# EasyEDA Pro project 【嘉立创】SguanFOC_MOTOR.epro, board PCB1
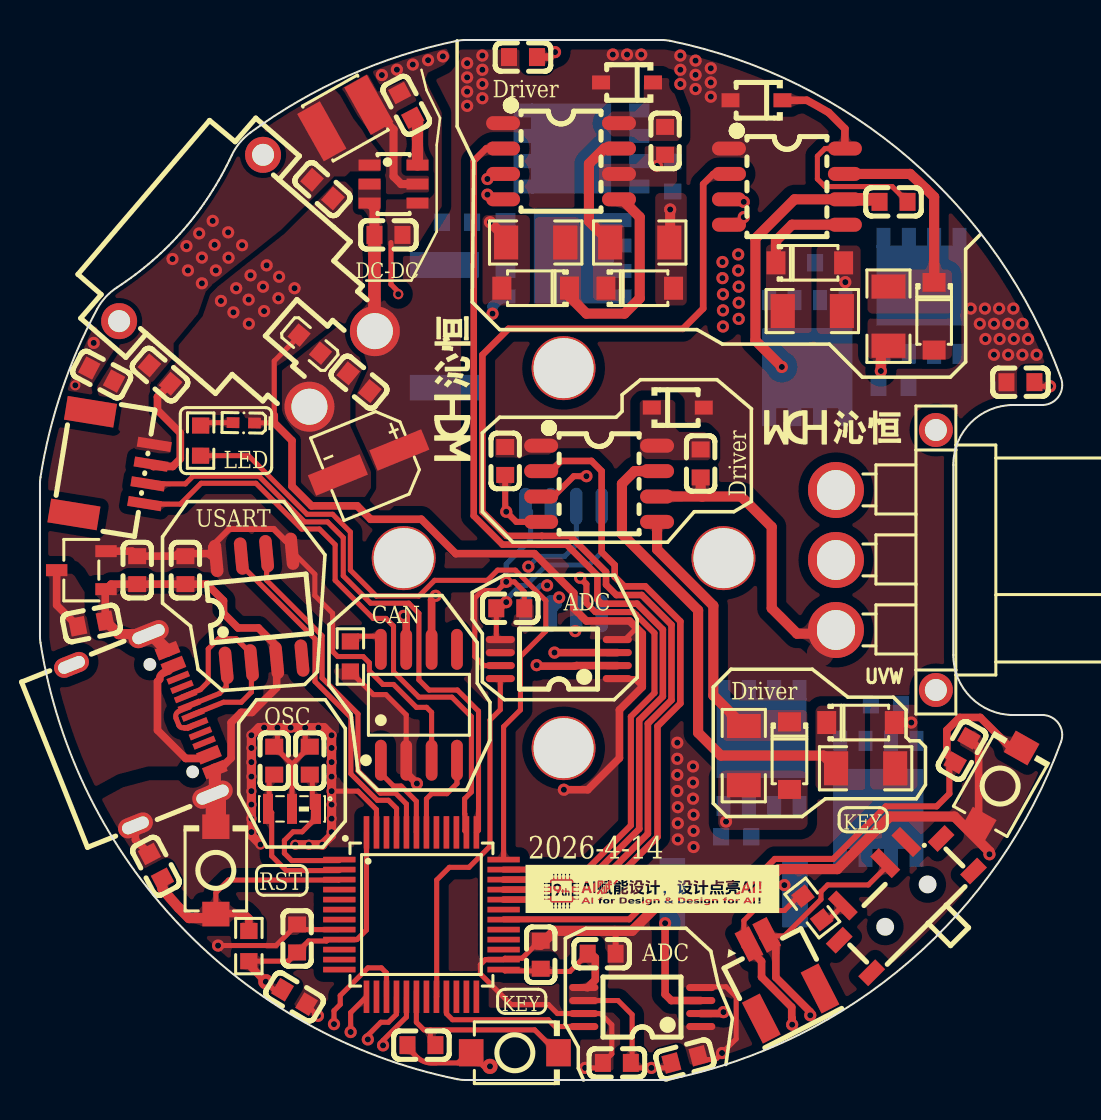
[diagram p1: board, top side]
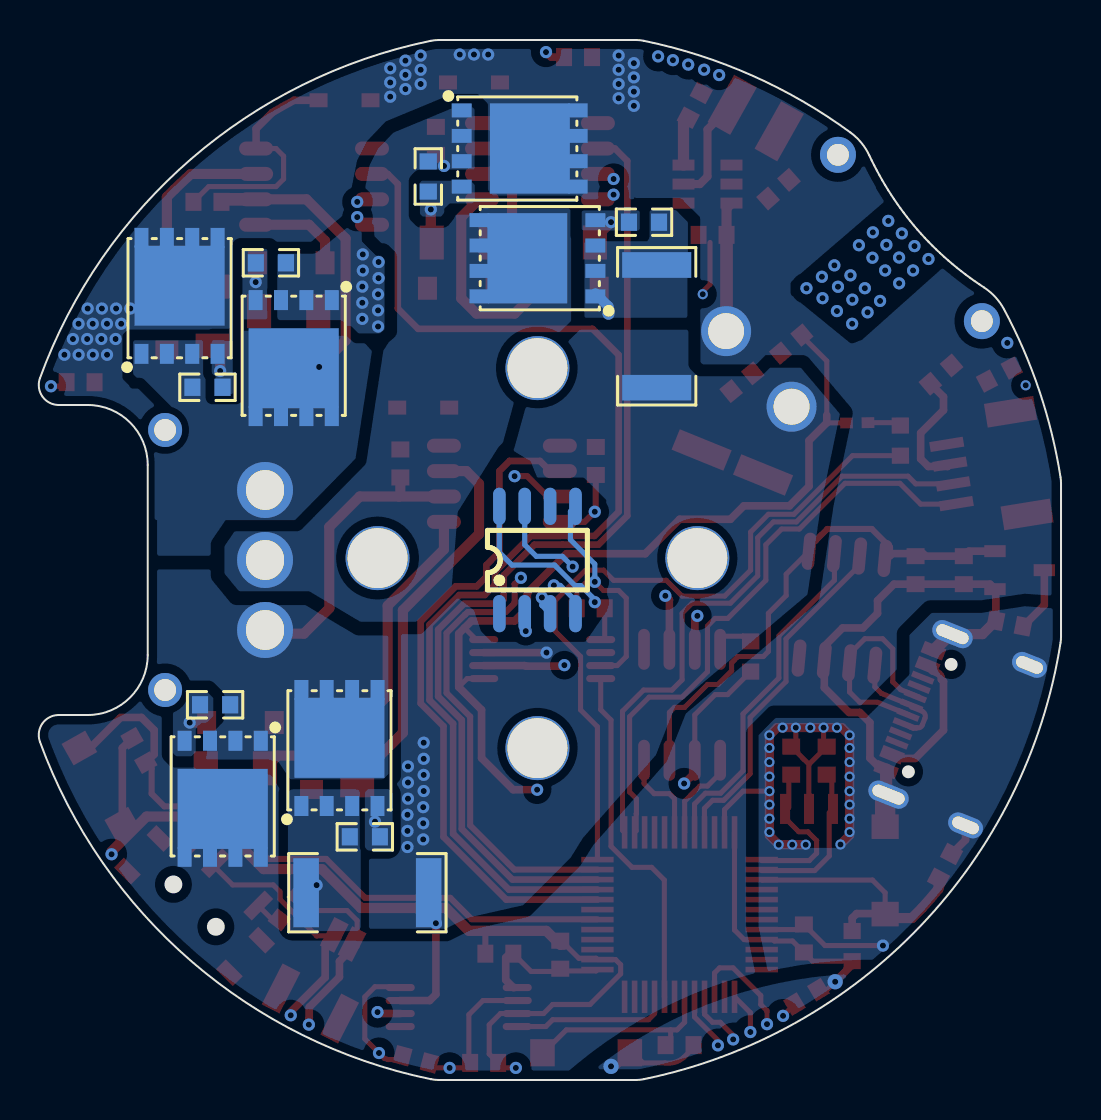
[diagram p2: board, bottom side, seen from below]

Outline 51.09 x 52 mm; copper layers: Top Layer, Inner1, Inner2, Bottom Layer. Coordinates in mm from the lower left corner of the outline.
Outline path: 0,29.82 0,22.18 arc(0.01,22.02) 0.02,21.87 arc(7.04,7.7) 20.87,0.04 arc(21.07,0.01) 21.28,0 31.12,0 arc(31.33,0.01) 31.53,0.04 arc(43.5,5.93) 51.09,16.91 arc(50.97,17.82) 50.15,18.25 48.7,18.25 arc(46.58,19.13) 45.7,21.25 45.7,30.75 arc(46.58,32.87) 48.7,33.75 50.15,33.75 arc(50.97,34.18) 51.09,35.09 arc(43.5,46.07) 31.53,51.96 arc(31.33,51.99) 31.12,52 21.28,52 arc(21.07,51.99) 20.87,51.96 arc(15.46,50.23) 10.54,47.38 arc(9.99,46.86) 9.6,46.23 9.47,45.98 9.35,45.72 9.22,45.48 9.08,45.23 8.94,44.99 8.8,44.75 8.66,44.51 8.51,44.28 8.36,44.05 8.2,43.82 8.04,43.59 7.88,43.37 7.71,43.16 7.54,42.94 7.37,42.73 7.19,42.52 7.01,42.32 6.83,42.12 6.64,41.92 6.44,41.72 6.25,41.53 6.05,41.34 5.85,41.16 5.64,40.97 5.43,40.79 5.21,40.62 5,40.44 4.78,40.28 4.55,40.11 4.32,39.95 4.09,39.78 3.85,39.63 arc(3.28,39.14) 2.85,38.54 arc(1.08,34.45) 0.02,30.13 arc(0.01,29.98) 0,29.82
Stack: Top Layer 0.035mm 外层铜厚1oz / Dielectric1 0.2104mm 7628 RC49% 8.6mil / Inner1 0.0152mm 内层铜厚 / Dielectric2 1.065mm 1.1mm H/HOZ Copper / Inner2 0.0152mm 内层铜厚 / Dielectric3 0.2104mm 7628 RC49% 8.6mil / Bottom Layer 0.035mm 外层铜厚1oz

## Design rules (mm)
net OSC-IN: DP1
net OSC-OUT: DP1
template: 自定义配置
spacing copperThickness1oz (default): track to track 0.102, other pairs 0.152 to 0.3
spacing copperThickness2oz: track to track 0.203, other pairs 0.152 to 0.3
track width copperThickness1oz (default): min 0.127, default 0.254, max 2.54
track width copperThickness2oz: min 0.203, default 0.254, max 2.54
differential pair differentialPair (default): width min 0.127, default 0.254, max 2.54; gap min 0.152, default 0.152
via viaSize (default): diameter min 0.5, default 0.61, max 10; hole min 0.3, default 0.305, max 6.3
net +3.3V uses sguan
net GND uses sguan
net +12V uses sguan
net A uses sguan
net B uses sguan
net AGND uses sguan
net +5V uses sguan
net C uses sguan
net $1N49078 uses sguan
net $1N49074 uses sguan
net MOS_AL uses sguan
net $1N49077 uses sguan
net MOS_AH uses sguan
net $1N49075 uses sguan
net MOS_BL uses sguan
net $1N49104 uses sguan
net MOS_BH uses sguan
net $1N49073 uses sguan
net MOS_CL uses sguan
net $1N49097 uses sguan
net MOS_CH uses sguan
net $1N49069 uses sguan
net I_A uses sguan
net $1N60408 uses sguan
net I_B uses sguan

## Placement (name value [footprint] x y rotation side)
C9  22uF  [C0603]  6.01 35.27 319.4 top
C10  22uF  [C0603]  14.14 44.54 318.4 top
C11  100nF  [C0603]  18.33 48.73 297.7 top
C12  10uF  [C0603]  17.44 42.26 0 top
C14  100nF  [C0603]  23.28 30.95 90 top
C15  100nF  [C0603]  32.27 1.03 194.9 top
C17  100nF  [C0603]  24.17 51.15 180 top
C19  100nF  [C0603]  49.06 34.89 180.2 top
C31  1uF  [C0603]  33.06 30.83 90 top
C32  1uF  [C0603]  31.28 46.95 90 top
C33  1uF  [C0603]  42.71 43.91 0 top
C37  10uF  [C0603]  4.86 25.49 90 top
C38  10uF  [C0603]  2.58 22.83 191.3 top
C57  100nF  [C0603]  5.8 10.68 297.8 top
C64  100nF  [C0603]  28.87 0.85 180 top
C65  100nF  [C0603]  23.53 23.59 0 top
C73  100nF  [C0603]  7.28 25.49 90 top
C74  100nF  [C0603]  12.86 7.08 270 top
C75  100nF  [C0603]  3.09 35.27 332.2 top
C76  22pF  [C0603]  13.5 15.97 90 top
C77  22pF  [C0603]  11.72 15.97 90 top
C78  10uF  [CAP-SMD_BD4.0-L4.3-W4.3-LS5.0-FD]  16.45 30.88 202.1 top
C79  22uF  [C0603]  15.96 34.89 140.7 top
C80  100nF  [C0603]  19.09 1.74 180 top
C81  100nF  [C0603]  12.74 4.16 149.1 top
C82  100nF  [C0603]  28.11 6.31 180 top
C85  100nF  [C0603]  25.06 6.26 270 top
C86  100nF  [C0603]  46.14 16.48 60.4 top
CAN  SN65HVD230DR  [SOIC-8_L4.9-W3.9-P1.27-LS6.0-BL]  18.96 18.76 0 top
CN  XT30PW-M  [CONN-TH_XT30PW-M]  11.34 38.83 229.1 top
D1  1N4148W-TP  [SOD-123_L2.8-W1.8-LS3.7-RD]  37.5 16.22 270 top
D2  1N4148W-TP  [SOD-123_L2.8-W1.8-LS3.7-RD]  41.06 17.87 0 top
D3  1N4148W-TP  [SOD-123_L2.8-W1.8-LS3.7-RD]  24.8 39.59 180 top
D4  1N4148W-TP  [SOD-123_L2.8-W1.8-LS3.7-RD]  30.01 39.59 0 top
D5  1N4148W-TP  [SOD-123_L2.8-W1.8-LS3.7-RD]  38.52 40.86 0 top
D6  1N4148W-TP  [SOD-123_L2.8-W1.8-LS3.7-RD]  44.74 38.19 270 top
DC-DC  AP63203WU-7  [TSOT-26_L2.9-W1.6-P0.95-LS2.8-BL]  17.69 44.8 270 top
L2  3.9uH  [IND-SMD_L3.0-W3.0_FNR30XXS]  15.28 48.1 29.4 top
MODE1  MSK12C02  [SW-TH_MSK12C02]  42.96 9.11 44.9 top
NOREF  -  [Pad_e203]  34.2 26.09 0 top
NOREF#2  -  [Pad_e201]  26.2 35.59 0 top
NOREF#3  -  [Pad_e204]  18.2 26.09 0 top
NOREF#4  -  [Pad_e202]  26.2 16.59 0 top
Q1  DON70N06  [DFN-8_L5.8-W4.9-P1.27-LS6.1-BL-2]  41.95 14.06 0 bottom
Q2  DON70N06  [DFN-8_L5.8-W4.9-P1.27-LS6.1-BL-2]  27.09 46.57 270 bottom
Q3  DON70N06  [DFN-8_L5.8-W4.9-P1.27-LS6.1-BL-2]  44.11 39.21 180 bottom
Q4  DON70N06  [DFN-8_L5.8-W4.9-P1.27-LS6.1-BL-2]  36.11 16.6 180 bottom
Q5  DON70N06  [DFN-8_L5.8-W4.9-P1.27-LS6.1-BL-2]  26.2 41.09 90 bottom
Q6  DON70N06  [DFN-8_L5.8-W4.9-P1.27-LS6.1-BL-2]  38.39 36.1 0 bottom
R3  100kΩ  [R0603]  42.33 18.76 0 bottom
R4  100kΩ  [R0603]  31.66 45.18 270 bottom
R5  100kΩ  [R0603]  42.71 34.64 180 bottom
R6  100kΩ  [R0603]  34.84 12.16 180 bottom
R7  100kΩ  [R0603]  20.87 42.89 0 bottom
R8  100kΩ  [R0603]  39.54 40.86 0 bottom
R11  2.2Ω  [R1206]  35.22 16.22 270 top
R12  2.2Ω  [R1206]  41.31 15.59 0 top
R13  2.2Ω  [R1206]  24.8 41.88 180 top
R14  2.2Ω  [R1206]  30.01 41.88 0 top
R15  2.2Ω  [R1206]  38.65 38.45 0 top
R16  2.2Ω  [R1206]  42.46 38.19 270 top
R34  5mΩ  [R2512]  20.23 37.68 90 bottom
R57  4.7kΩ  [R0603]  15.53 21.17 270 top
R58  120Ω  [R0603]  38.65 8.6 308 top
R59  CBM160808U000T  [L0603]  13.5 36.8 319.9 top
R60  10kΩ  [R0603]  10.45 6.7 90 top
R61  1kΩ  [R0603]  8.04 31.97 89.8 top
R63  5mΩ  [R2512]  34.71 9.36 0 bottom
SW1  TS-1088-AR02016  [SW-SMD_L3.9-W3.0-P4.45]  8.8 10.48 90 top
SW2  TS-1088-AR02016  [SW-SMD_L3.9-W3.0-P4.45]  23.76 1.36 0 top
SW3  TS-1088-AR02016  [SW-SMD_L3.9-W3.0-P4.45]  48.04 14.7 60.6 top
U6  EG2104  [SOP-8_L5.0-W4.0-P1.27-LS6.2-BL]  27.98 29.81 270 top
U8  XC6206P332MR-G  [SOT-23-3_L2.9-W1.6-P1.90-LS2.8-BR]  2.07 25.49 0 top
U9  KTH7823-X-N-SOP8  [SOP-8_L4.9-W3.9-P1.27-LS6.0-BL]  26.2 26 180 bottom
U10  FR107WS  [SOD-323_L1.6-W1.3-LS2.7-RD]  31.92 33.62 0 top
U11  EG2104  [SOP-8_L5.0-W4.0-P1.27-LS6.2-BL]  26.07 45.94 270 top
U12  FR107WS  [SOD-323_L1.6-W1.3-LS2.7-RD]  29.38 49.88 180 top
U13  EG2104  [SOP-8_L5.0-W4.0-P1.27-LS6.2-BL]  37.38 44.67 270 top
U14  FR107WS  [SOD-323_L1.6-W1.3-LS2.7-RD]  35.85 48.99 180 top
U28  XL-1005UOC  [LED0402-RD_ORANGE]  10.2 32.86 179 top
U34  INA240A2PWR  [TSSOP-8_L4.4-W3.0-P0.65-LS6.4-BL]  30.14 3.65 90 top
U35  INA240A2PWR  [TSSOP-8_L4.4-W3.0-P0.65-LS6.4-BL]  25.96 21.05 90 top
U38  ZX-SH1.0-2PWT  [CONN-SMD_2P-P1.00_HX-1.0-2P-WT]  36.74 5.43 27.1 top
U39  CH32V305CCT6  [LQFP-48_L7.0-W7.0-P0.50-LS9.0-BL_1]  19.09 8.27 270 top
UART  CH340N  [SOP-8_L4.9-W3.9-P1.27-LS6.0-BL]  10.96 23.59 5.4 top
USB  TYPE-C16PIN  [USB-C-SMD_TYPE-C16PIN]  5.37 17.62 291.7 top
UVW  MR30PW-F  [CONN-TH_MR30PW-F]  42.33 26 90 top
W-Link  SH1.0-4P  [CONN-SMD_4P-P1.00_SH1.0-4P]  3.8 30.57 260.8 top
X1  8MHz  [OSC-SMD_3P-L3.2-W1.3-P1.20]  12.61 13.55 180 top

## Footprints (pads in the part's own frame, mm; a bottom-side part is the same pattern mirrored in y, then rotated)
C0603
  rect 0.8x0.9 smd: 1(-0.7,0) 2(0.7,0)
CAP-SMD_BD4.0-L4.3-W4.3-LS5.0-FD
  rect 2.8x1.1 smd: 1(-1.661,0) 2(1.661,0)
CONN-SMD_2P-P1.00_HX-1.0-2P-WT
  rect 0.8x1.6 smd: 1(-0.5,1.8) 2(0.5,1.8)
  rect 1x2.3 smd: 3(1.65,-1.8) 4(-1.65,-1.8)
CONN-SMD_4P-P1.00_SH1.0-4P
  rect 0.5x1.7 smd: 1(-1.5,1.705) 2(-0.5,1.705) 3(0.5,1.705) 4(1.5,1.705)
  rect 1.2x2.5 smd: 5(-2.6,-1.705) 6(2.6,-1.705)
CONN-TH_MR30PW-F
  round 2.8 hole 1.995x1.9: 1(-3.5,2.5) 2(0,2.5) 3(3.5,2.5)
  round 1.7 hole 1.1: 4(6.5,-2.5) 5(-6.5,-2.5)
CONN-TH_XT30PW-M
  round 2.5 hole 1.8: 1(-2.5,5) 2(2.5,5)
  round 1.8 hole 1.1: 3(5.5,-5) 4(-5.5,-5)
DFN-8_L5.8-W4.9-P1.27-LS6.1-BL-2
  rect 0.7x1 smd: 1(-1.905,-2.9) 2(-0.635,-2.9) 3(0.635,-2.9) 4(1.905,-2.9) 5(1.905,2.9) 6(0.635,2.9) 7(-0.635,2.9) 8(-1.905,2.9)
  rect 4.51x4 smd: 8(0,0.508)
IND-SMD_L3.0-W3.0_FNR30XXS
  rect 1.3x2.72 smd: 1(1.35,0) 2(-1.35,0)
L0603
  rect 0.8x0.864 smd: 1(-0.7,0) 2(0.7,0)
LED0402-RD_ORANGE
  rect 0.636x0.54 smd: 1(-0.538,0) 2(0.538,0)
LQFP-48_L7.0-W7.0-P0.50-LS9.0-BL_1
  rect 0.28x1.62 smd: 1(-2.75,-4.11) 2(-2.25,-4.11) 3(-1.75,-4.11) 4(-1.25,-4.11) 5(-0.75,-4.11) 6(-0.25,-4.11) 7(0.25,-4.11) 8(0.75,-4.11) 9(1.25,-4.11) 10(1.75,-4.11) 11(2.25,-4.11) 12(2.75,-4.11) 25(2.75,4.11) 26(2.25,4.11) 27(1.75,4.11) 28(1.25,4.11) 29(0.75,4.11) 30(0.25,4.11) 31(-0.25,4.11) 32(-0.75,4.11) 33(-1.25,4.11) 34(-1.75,4.11) 35(-2.25,4.11) 36(-2.75,4.11)
  rect 1.62x0.28 smd: 13(4.11,-2.75) 14(4.11,-2.25) 15(4.11,-1.75) 16(4.11,-1.25) 17(4.11,-0.75) 18(4.11,-0.25) 19(4.11,0.25) 20(4.11,0.75) 21(4.11,1.25) 22(4.11,1.75) 23(4.11,2.25) 24(4.11,2.75) 37(-4.11,2.75) 38(-4.11,2.25) 39(-4.11,1.75) 40(-4.11,1.25) 41(-4.11,0.75) 42(-4.11,0.25) 43(-4.11,-0.25) 44(-4.11,-0.75) 45(-4.11,-1.25) 46(-4.11,-1.75) 47(-4.11,-2.25) 48(-4.11,-2.75)
OSC-SMD_3P-L3.2-W1.3-P1.20
  rect 0.5x1.5 smd: 1(-1.2,0) 2(0,0) 3(1.2,0)
Pad_e201
  round 3.2 hole 3: 1(0,0)
Pad_e202
  round 3.2 hole 3: 2(0,0)
Pad_e203
  round 3.2 hole 3: 3(0,0)
Pad_e204
  round 3.2 hole 3: 4(0,0)
R0603
  rect 0.806x0.864 smd: 1(-0.753,0) 2(0.753,0)
R1206
  rect 1.208x1.701 smd: 1(-1.479,0) 2(1.479,0)
R2512
  rect 1.282x3.456 smd: 1(-3.067,0) 2(3.067,0)
SOD-123_L2.8-W1.8-LS3.7-RD
  rect 0.95x1.15 smd: 1(-1.692,0) 2(1.692,0)
SOD-323_L1.6-W1.3-LS2.7-RD
  rect 0.9x0.7 smd: 1(-1.3,0) 2(1.3,0)
SOIC-8_L4.9-W3.9-P1.27-LS6.0-BL
  oval 0.588x2.045 smd: 1(-1.905,-2.772) 2(-0.635,-2.772) 3(0.635,-2.772) 4(1.905,-2.772) 5(1.905,2.772) 6(0.635,2.772) 7(-0.635,2.772) 8(-1.905,2.772)
SOP-8_L4.9-W3.9-P1.27-LS6.0-BL
  oval 0.63x1.865 smd: 1(-1.905,-2.683) 2(-0.635,-2.683) 3(0.635,-2.683) 4(1.905,-2.683) 5(1.905,2.683) 6(0.635,2.683) 7(-0.635,2.683) 8(-1.905,2.683)
SOP-8_L5.0-W4.0-P1.27-LS6.2-BL
  oval 0.7x1.7 smd: 1(-1.905,-2.9) 2(-0.635,-2.9) 3(0.635,-2.9) 4(1.905,-2.9) 5(1.905,2.9) 6(0.635,2.9) 7(-0.635,2.9) 8(-1.905,2.9)
SOT-23-3_L2.9-W1.6-P1.90-LS2.8-BR
  rect 1.07x0.6 smd: 1(1.235,-0.95) 2(1.235,0.95) 3(-1.235,0)
SW-SMD_L3.9-W3.0-P4.45
  rect 1.23x1.36 smd: 1(-2.185,0) 2(2.185,0)
SW-TH_MSK12C02
  rect 0.6x1.524 smd: 1(-2.25,1.7) 2(0.75,1.7) 3(2.25,1.7)
  rect 1.2x0.7 smd: 4(-3.6,0.6) 4(-3.6,-1.7) 4(3.6,0.6) 4(3.6,-1.7)
TSOT-26_L2.9-W1.6-P0.95-LS2.8-BL
  rect 0.55x1.1 smd: 1(-0.95,-1.2) 2(0,-1.2) 3(0.95,-1.2) 4(0.95,1.2) 5(0,1.2) 6(-0.95,1.2)
TSSOP-8_L4.4-W3.0-P0.65-LS6.4-BL
  oval 0.353x1.454 smd: 1(-0.975,-2.927) 2(-0.325,-2.927) 3(0.325,-2.927) 4(0.975,-2.927) 5(0.975,2.927) 6(0.325,2.927) 7(-0.325,2.927) 8(-0.975,2.927)
USB-C-SMD_TYPE-C16PIN
  oval 1x2.1 hole 0.6x1.7: 1(-4.32,1.788) 2(4.32,1.788)
  oval 1x1.8 hole 0.6x1.4: 3(-4.32,-2.362) 4(4.32,-2.362)
  rect 0.6x1.15 smd: A1B12(-3.2,2.363) A4B9(-2.4,2.362) B1A12(3.2,2.362) B4A9(2.4,2.362)
  rect 0.3x1.15 smd: A5(-1.25,2.362) A6(-0.25,2.362) A7(0.25,2.362) A8(1.25,2.362) B5(1.75,2.362) B6(0.75,2.362) B7(-0.75,2.362) B8(-1.75,2.362)

## Nets
As in the schematic.

Pads without a net: CAN 5; CN 3 4; MODE1 3 4; NOREF 3; NOREF#2 1; NOREF#3 4; NOREF#4 2; U9 1 6; U38 3 4; U39 4 5 6 7 10 11 12 14 19 22 23 24 27 28 29 31 39 40 41 46; UART 4; USB A5 A8 B5 B8; UVW 4 5; W-Link 5 6

## Via types
v1: diameter 0.61, hole 0.305, Top Layer to Bottom Layer, 134 vias
v2: diameter 0.762, hole 0.305, Top Layer to Bottom Layer, 2 vias
v3: diameter 0.508, hole 0.305, Top Layer to Bottom Layer, 27 vias

## Routing (per net, layer and track width the routed paths; a pad name or vN(x,y) marks a point on that pad's centre or on a via; arc(x,y) is an arc through that point)
+3.3V: length 68.1
  Top Layer w0.254: 27.21,3.97 28.92,3.97 29.63,3.27 29.63,0.92 C64.1 ; U35.5 22.83,22.02 C65.1 ; 12.6,26.44 13.75,25.29 13.75,24.22 14.64,23.33 14.64,21.43 14.9,21.17 16.17,21.17 16.48,20.86 16.48,20.45 17.16,19.78 17.69,19.78 18.83,18.63 19.34,18.63 19.6,18.38 19.6,15.99 ; v2(11.3,4.91) 11.7,4.52 C81.2 ; R60.1 12.43,5.94 C74.2 13.44,6.95 14.34,6.95 14.41,7.02 U39.9 15.86,7.02 16.34,7.5 U39.48 ; v2(22.52,0.68) 22.21,0.68 21.48,1.41 20.92,0.85 19.82,0.85 arc(19.31,0.89) 18.87,1.13 18.39,1.62 C80.2 ; 23.2,5.52 23.27,5.45 24.84,5.45 24.86,5.43 26.52,5.43 27.15,6.06 ; C15.2 31.35,0.6 v1(30.59,0.6) 29.56,0.6 29.31,0.85 ; 23.09,23.59 23.33,23.83 v1(23.33,23.89)
  Top Layer w0.305: 12.35,27.02 12.29,26.96 11.69,27.55 9.47,27.55 8.56,26.64 8.56,26.21
  Top Layer w0.381: 7.15,26.32 8.44,26.32 8.56,26.21 ; U8.2 4.61,26.44 4.86,26.19 6.77,26.19 6.9,26.32 ; v2(11.3,4.91) 10.45,5.76 R60.1 ; C82.2 27.59,6.31 27.79,6.12 27.79,5 27.41,4.62 27.34,4.62
  Bottom Layer w0.254: U9.8 28.11,26.38 27.47,25.75 25.34,25.75 24.32,24.72 24.03,24.72 23.33,24.02 v1(23.33,23.89)
  vias: v1(6.63,41.05) v1(7.33,41.7) v1(7.4,40.48) v1(7.97,42.33) v1(8.1,39.83) v1(8.1,41.12) v1(8.64,42.96) v1(8.74,41.76) v1(8.8,40.48) v1(9.42,42.38) v1(9.44,41.11) v1(10.11,41.74)
+5V: length 9.8
  Top Layer w0.381: C38.2 0.84,23.74 U8.3 ; 8.21,16.17 8.11,16.08 7.29,16.08 5.88,17.49 5.88,19.92 5.99,20.03 arc(6.04,20.23) 6.2,20.36 6.43,20.45 6.68,20.7 USB.A4B9
+12V: length 6.5
  Top Layer w0.508: C12.1 16.74,43.6 DC-DC.3
  Top Layer w0.635: CN.1 16.74,37.46 C12.1
  vias: v1(21.37,50.84) v1(21.37,50.13) v1(21.37,49.42) v1(21.37,48.71) v1(22.14,51.22) v1(22.14,50.51) v1(22.14,49.8) v1(22.14,49.09) v1(28.66,51.27) v1(29.38,51.27) v1(30.09,51.27) v1(32.04,51.22) v1(32.04,50.51) v1(32.04,49.8) v1(32.8,50.97) v1(32.8,50.26) v1(32.8,49.55) v1(33.57,50.59) v1(33.57,49.88) v1(33.57,49.17) v1(46.57,38.57) v1(47.03,37.81) v1(47.28,38.57) v1(47.31,37.05) v1(47.74,37.81) v1(47.73,36.26) v1(47.99,38.57) v1(48.02,37.05) v1(48.45,37.81) v1(48.45,36.26) v1(48.7,38.57) v1(48.73,37.05) v1(49.16,37.81) v1(49.16,36.26) v1(49.44,37.05) v1(49.87,36.26)
AGND: length 8.6
  Top Layer w0.381: U34.3 31.59,3.97 31.28,4.28 v1(31.28,7.84) ; v1(25.74,21.37) 28.89,21.37
  vias: v1(31.89,16.87) v1(31.89,16.06) v1(31.89,15.25) v1(31.89,14.45) v1(31.92,13.64) v1(31.92,12.84) v1(31.92,12.03) v1(32.68,15.68) v1(32.68,14.87) v1(32.68,14.07) v1(32.7,13.26) v1(32.7,12.45) v1(32.7,11.65) v1(34.15,40.9) v1(34.15,40.09) v1(34.17,39.29) v1(34.17,38.48) v1(34.17,37.67) v1(34.94,41.28) v1(34.94,40.47) v1(34.96,39.67) v1(34.96,38.86) v1(34.96,38.06)
GND: length 194.8
  Top Layer w0.254: v3(13.27,17.62) 13.27,16.9 C76.2 12.61,15.78 ; CAN.2 18.33,18.25 17.31,19.27 16.68,19.27 R57.2 ; 28.89,22.02 29.27,22.02 29.85,22.6 ; 11.72,32.86 10.75,32.86 10.74,32.85 ; C81.1 13.34,3.78 v1(13.91,3.21) ; v3(17.93,39.29) 17.93,39.42 17.56,39.78 17.56,41.88 ; v1(50.54,34.69) 49.97,34.69 49.76,34.89 ; C15.1 33.14,1.02 33.68,1.02 arc(33.77,1.05) 33.85,1.08 33.85,1.08 v1(34.13,1.35) 34.84,2.06 34.84,4.16 34.33,4.66 33.11,4.66 U34.4 ; 11.72,33.24 11.72,35.95 13.05,37.28 ; v1(8.91,6.72) 11.81,6.72 C74.1 13.12,7.52 U39.8 ; v3(14.59,14.44) 15.91,14.44 16.84,13.52 U39.47 ; 28.89,20.07 29.72,20.07 30.14,19.65 ; 12.61,15.78 C77.2 11.88,16.83 v3(11.88,17.62) ; 12.61,15.78 X1.2 ; C85.1 25.01,6.96 24.13,6.09 23.27,6.09 23.2,6.02 22.29,6.02 22.04,5.77 22.04,5.31 23.57,3.78 25.44,3.78 25.89,3.32 28.05,3.32 28.61,2.76 28.61,1.3 27.92,0.6 v1(27.28,0.6) ; U35.7 22.21,20.72 21.76,21.17 21.76,24.09 22.14,24.48 22.9,24.48 v1(23.33,24.91) 23.74,24.91 24.23,24.41 C65.2
  Top Layer w0.305: U6.4 23.84,27.91 v1(23.33,28.41) 23.28,28.46 C14.1 ; v1(35.22,43.14) 34.84,42.76 U13.4 ; 28.75,7.46 28.8,7.41 C82.1
  Top Layer w0.381: 5.56,30.79 5.68,30.68 6.64,30.68 7.02,31.06 7.02,32.35 5.88,33.49 5.88,34.16 6.54,34.82 ; v1(25.77,51.39) 25.52,51.15 24.87,51.15 ; C86.2 46.97,16.6 46.97,12.79 ; 11.72,33.24 11.72,32.86 12.61,31.97 12.61,29.68 13.59,28.71 15.87,28.71 16.54,28.04 19.08,28.04 20.8,26.31 24.74,26.31 26.71,24.35 26.71,23.59 27.34,22.95 29.5,22.95 30.14,22.32 30.14,19.65 28.99,18.51 28.99,16.09 27.41,14.51 v1(26.21,14.51) ; C38.1 3.26,24.5 U8.1 3.56,24.79 C37.1 C73.1 8.36,24.79 9.18,23.97 9.18,23.33 9.91,22.6 10.93,22.6 11.85,21.69 UART.3 11.85,19.62 10.61,18.38 10.07,18.38 9.56,17.87 9.56,16.09 8.99,15.52 USB.B1A12 ; v1(18.86,14.82) 18.33,15.36 CAN.2 ; C57.1 4.78,12 USB.4
  Top Layer w0.457: v3(11.04,11.78) 10.58,12.23 v3(10.58,12.4) v3(10.58,13.07) v3(10.58,13.77) v3(10.58,14.44) v3(10.58,15.17) v3(10.58,15.89) v3(10.58,16.6) v3(10.58,17.24) 10.96,17.62 v3(11.21,17.62) v3(11.88,17.62) v3(12.55,17.62) v3(13.27,17.62) v3(13.93,17.62) 14.21,17.62 v3(14.59,17.24) v3(14.59,16.6) v3(14.59,15.89) v3(14.59,15.17) v3(14.59,14.44) v3(14.59,13.77) v3(14.59,13.07) v3(14.59,12.4) 14.59,12.23 v3(14.13,11.76) v3(13.45,11.76) v3(12.78,11.76)
  Top Layer w0.508: C38.1 3.93,22.29 USB.1 ; 24.87,6.76 25.06,6.76 25.75,7.46 29.63,7.46 30.77,8.6 35.04,8.6 36.98,10.54 39.9,10.54 42.53,13.17 45.76,13.17 47.51,11.42 v1(47.51,11.29)
  Top Layer w0.61: USB.A1B12 5.55,22.29 USB.1 ; USB.B1A12 8.75,14.39
  Top Layer w1.016: 8.8,12.69 8.8,14.1 USB.2
  Bottom Layer w0.254: v1(23.33,24.91) 23.33,25.8 24.55,27.02 24.55,28.43 U9.5
  vias: v1(2.69,36.86) v1(9.06,38.95) v1(9.68,38.38) v1(9.82,39.59) v1(10.44,39.02) v1(10.45,37.81) v1(10.54,40.23) v1(11.16,39.66) v1(11.21,38.45) v1(11.34,40.73) v1(11.97,40.16) v1(11.93,39.09) v1(12.74,39.59) v1(17.11,50.25) v1(17.86,50.52) v1(18.66,50.77) v1(19.42,50.99) v1(20.16,51.18) v1(22.39,44.27) v3(1.77,34.73)
A: length 15.2
  Top Layer w0.508: 33.13,29.17 35.09,29.17 36.61,27.65 36.61,23.59 37.88,22.32 39.65,22.32 39.83,22.5 ; 33.13,29.17 U6.6 ; 33.13,29.17 33.06,29.25 C31.1
ADC_A: length 8
  Top Layer w0.254: U39.21 20.34,3.32 20.64,3.01 25.44,3.01 25.78,2.67 27.21,2.67
ADC_B: length 17.8
  Top Layer w0.254: U39.20 19.85,4.17 19.85,10 20.48,10.63 21.47,10.63 22.52,11.68 22.52,18 23.03,18.52 U35.8
B:
  vias: v1(30.87,45.7)
C: length 15.3
  Top Layer w0.508: 40.15,44.03 37.76,44.03 35.8,42.08 35.8,36.98 v1(37.12,35.65)
  Top Layer w0.635: 40.15,44.03 41.88,44.03 C33.1
  Bottom Layer w0.254: Q6.8 37.19,35.59 v1(37.12,35.65)
CAN2_RX: length 4.8
  Top Layer w0.254: U39.42 19.34,14.06 19.6,14.32 20.36,14.32 20.87,14.82 20.87,16.12
CAN2_TX: length 4.7
  Top Layer w0.254: U39.43 18.83,12.39 18.83,13.94 18.07,14.7 17.69,14.7 17.06,15.33 17.06,16.12
D+: length 5.6
  Top Layer w0.254: UART.1 9.32,19.66 8.99,19.33 USB.A6 7.47,18.65 6.97,18.45 arc(6.81,18.3) 6.81,18.08 6.95,17.74 arc(7.06,17.63) 7.22,17.62 7.25,17.59 7.39,17.59 7.54,17.65 7.58,17.69 USB.B6
D-: length 11.1
  Top Layer w0.254: 7.11,19.15 8.03,19.52 8.42,19.91 8.42,21.56 8.93,22.06 9.82,22.06 10.58,21.3 UART.2 10.58,19.4 10.07,18.89 9.18,18.89 7.62,18.26
I_A: length 9.9
  Top Layer w0.381: U34.2 34.13,3.32 v1(34.2,3.39)
  Inner2 w0.508: v1(34.2,3.39) 35.09,3.39 37.25,5.55 v1(37.25,9.74)
  Bottom Layer w0.254: v1(37.25,9.74) 37.5,9.49 37.78,9.49
I_B: length 23.9
  Top Layer w0.381: v1(24.85,20.74) 24.9,20.69 26.73,20.69 arc(26.79,20.7) 26.85,20.72 28.89,20.72
  Inner2 w0.508: v1(24.85,20.74) 22.62,22.98 22.62,38.29 v1(22.64,38.32)
  Bottom Layer w0.508: v1(22.64,38.32) 22.64,38.68 23.3,39.34
KEY1: length 9.8
  Top Layer w0.254: 19.53,2.5 24.75,2.5 25.85,1.41 ; 19.53,2.5 19.22,2.5 18.83,2.89 18.83,4.46 ; 19.53,2.5 19.53,1.87
KEY2: length 33
  Top Layer w0.305: 23.21,8.03 29.49,8.03 30.56,9.11 34.83,9.11 36.77,11.05 39.69,11.05 42.32,13.68 44.87,13.68 45.5,14.32 45.5,15.58 C86.1
  Top Layer w0.381: C86.1 45.38,16.28 45.38,17.49 46.01,18.13 47.05,18.13 48.58,16.6 49.12,16.6
LED: length 36.3
  Top Layer w0.254: R61.1 10.43,31.22 13.36,28.29 14.64,28.29 15.53,27.4 15.53,25.49 16.83,24.2 18.96,24.2 19.75,24.98 22.39,24.98 22.9,25.49 23.79,25.49 25.31,23.97 25.31,22.44 24.04,21.17 24.04,18.51 23.2,17.66 23.2,11.02
MOS_AH: length 0.8
  Top Layer w0.508: D2.2 v1(43.6,17.87)
MOS_AL:
  vias: v1(34.33,12.92)
MOS_BH: length 1.7
  Top Layer w0.508: R14.2 31.53,41.92 v1(31.53,43.53)
MOS_BL: length 1.4
  Top Layer w0.508: R13.2 23.32,42.08 v1(22.52,42.89)
MOS_CH: length 1.7
  Top Layer w0.508: v1(42.08,35.45) 42.08,36.46 42.58,36.97
MOS_CL:
  vias: v1(40.3,39.89)
OSC-IN: length 8
  Top Layer w0.254: C76.1 13.5,15.14 13.63,15.01 13.63,13.61 13.68,13.55 X1.1 13.68,13.43 13.68,12.98 13.12,12.41 12.67,12.41 12.23,11.97 12.23,11.34 12.6,10.97 14.98,10.97
OSC-OUT: length 8
  Top Layer w0.254: 14.98,10.47 12.33,10.47 11.6,11.2 11.6,13.37 X1.3 11.47,13.61 11.47,15.01 C77.1
PWM-A: length 33.5
  Top Layer w0.33: 23.2,9.02 27.76,9.02 30.9,12.16 30.9,17.69 32.04,18.83 32.04,22.93 30.29,24.68 29.24,24.68 28.76,25.16 28.76,25.75 28.11,26.4 28.11,30.45 27.6,30.95 26.07,30.95 25.57,30.45 U6.2
PWM-B: length 50.1
  Top Layer w0.33: 23.2,10.02 27.45,10.02 29.99,12.56 29.99,18 31.17,19.18 31.17,22.52 29.87,23.82 28.11,23.82 27.89,24.03 27.89,25.23 26.35,26.77 24.94,26.77 24.93,26.77 23.14,26.77 21.7,28.21 21.7,45.95 22.33,46.57 22.79,46.57 22.92,46.7
PWM-C: length 59.6
  Top Layer w0.33: 34.98,45.3 33.69,45.3 33.19,44.8 33.19,38.57 32.17,37.56 23.44,37.56 22.14,36.25 22.14,28.41 23.34,27.2 25.11,27.2 25.11,27.2 26.53,27.2 28.32,25.41 28.32,24.76 28.84,24.25 30.11,24.25 31.6,22.76 31.6,19 30.42,17.82 30.42,12.31 27.63,9.52 23.2,9.52
RST: length 13.8
  Top Layer w0.254: 8.8,8.32 8.8,9.36 9.44,10 14.95,10 U39.3
  Top Layer w0.381: 8.8,8.32 10.22,8.32 10.45,8.09 R60.2
  Top Layer w0.508: 6.13,10.06 6.13,9.56 arc(6.53,9.08) 6.95,8.6 7.46,8.1 8.59,8.1 8.8,8.31 8.8,8.32
SD: length 65.7
  Top Layer w0.305: v1(27.03,25.11) 27.34,24.79 27.34,23.84 27.79,23.4 29.69,23.4 29.81,23.27 29.82,23.27 30.75,22.35 30.75,19.35 29.57,18.17 29.57,12.73 27.36,10.52 23.2,10.52 ; 34.35,44.03 34.48,43.91 v1(35.22,43.91) ; v1(27.34,30.19) 26.71,30.19 25.69,29.17 U6.3
  Inner2 w0.508: v1(27.34,30.19) 28.74,31.59 28.74,34.76 ; 28.74,34.76 29.63,35.65 32.17,35.65 32.93,36.41 32.93,42.38 34.45,43.91 v1(35.22,43.91) ; 28.74,34.76 28.74,36.8 27.34,38.19 27.34,43.91 26.2,45.05 v1(22.39,45.05)
  Inner2 w0.635: v1(27.34,30.19) 27.03,29.87 v1(27.03,25.11)
SPI1_CS: length 29.1
  Top Layer w0.254: U39.13 15.55,3.37 v1(15.55,2.4)
  Inner1 w0.254: v1(15.55,2.4) 17.05,3.9 17.06,3.9 17.44,4.28 17.44,15.59 v1(25.98,24.13)
  Bottom Layer w0.254: v1(25.98,24.13) 25.98,23.73 U9.3
SPI1_MISO: length 33.5
  Top Layer w0.254: U39.16 17.84,3.29 17.44,2.89 17.06,2.89 16.41,2.24 v1(16.41,2.03)
  Inner1 w0.254: v1(16.41,2.03) 17.79,3.42 17.79,15.44 24.42,22.06 25.06,22.06 26.71,23.71 26.71,24.35 26.26,24.79 25.44,24.79 v1(25.38,24.73)
  Bottom Layer w0.254: v1(25.38,24.73) 25.06,24.73 24.3,23.97 U9.4
SPI1_MOSI: length 30.1
  Top Layer w0.254: U39.17 18.34,3.15 17.17,1.98 v1(17.17,1.73)
  Inner1 w0.254: v1(17.17,1.73) 18.15,2.71 18.15,15.29 22.76,19.9 25.44,19.9 26.78,21.25 v1(26.78,22.44)
  Bottom Layer w0.254: U9.2 26.83,22.49 v1(26.78,22.44)
SPI1_SCK: length 37.4
  Top Layer w0.254: v1(14.71,2.79) 14.71,3.46 15.02,3.78 15.02,4.22 16.41,5.61 17.08,5.61 17.34,5.35 U39.15
  Inner1 w0.254: v1(24.44,25.67) 24.42,25.65 24.42,23.07 17.06,15.71 17.06,5.14 v1(14.71,2.79)
  Bottom Layer w0.254: U9.7 26.83,26.76 26.26,26.18 24.95,26.18 v1(24.44,25.67)
UART6_TX: length 17.4
  Top Layer w0.254: 10.08,26.2 10.08,25.74 13.76,22.06 13.76,19.92 15.56,18.13 15.56,15.31 16.88,13.98 17.44,13.98 17.84,13.58 17.84,12.39 U39.45
USART1_RX: length 17.3
  Top Layer w0.254: UART.6 11.34,24.99 14.12,22.21 14.12,20.1 15.91,18.3 15.91,15.46 17.03,14.34 17.79,14.34 18.34,13.8 U39.44
WCLK: length 30
  Top Layer w0.254: W-Link.4 5.27,28.79 7.02,28.79 8.06,29.84 10.81,29.84 13.09,27.55 13.98,27.55 14.77,26.76 14.77,24.98 16.67,23.08 17.31,23.08 17.69,22.7 17.69,20.41 18.96,19.14 20.61,19.14 21.59,18.17 21.59,14.4 21.25,14.06 21.25,13.32 21.26,13.31 21.26,12.46 U39.38
WDIO: length 30.7
  Top Layer w0.254: U39.37 21.94,12.49 21.94,18.44 20.89,19.5 19.47,19.5 18.96,20.01 18.96,23.33 18.45,23.84 16.54,23.84 15.18,25.21 15.18,27.12 14.39,27.91 13.24,27.91 10.96,30.19 7.66,30.19 7.27,29.81 W-Link.3
$1N31257: length 73.4
  Top Layer w0.254: 38.05,9.07 37.84,9.07 37.25,8.47 35.73,8.47 35.22,7.97 35.22,6.67
  Top Layer w0.381: v1(37.64,2.77) 37.64,3.08 37.62,3.1 37.62,3.64 36.11,5.15 36.11,5.93 35.46,6.58 35.46,6.79 ; v1(18.2,23.21) 18.33,23.08 CAN.7
  Inner1 w0.559: v1(18.2,23.21) 20.05,23.21 21.02,24.18 21.02,30.04 23.83,32.86 39.74,32.86 41.82,30.78 41.82,9.79 39.98,7.94 39.98,5.08 39.29,4.4 38.48,4.4 37.64,3.56 v1(37.64,2.77)
$1N31258: length 76.2
  Top Layer w0.254: 36.11,7.13 36.19,7.2 ; 42.29,10.84 42.29,10.6 41.45,9.75 39.42,9.75 39.08,9.42 39.08,9.03 37.25,7.2 36.44,7.2
  Top Layer w0.381: 19.6,21.53 19.6,24.01 v1(19.8,24.21) ; v1(38.54,3.24) 38.54,3.41 36.82,5.13 36.82,6.82 36.44,7.2 36.38,7.27
  Inner1 w0.559: v1(38.54,3.24) 38.6,3.24 arc(39.63,3.83) 40.64,4.47 40.64,7.67 42.48,9.52 42.48,31.05 39.97,33.56 23.6,33.56 20.36,30.32 20.36,24.77 v1(19.8,24.21)
$1N31259: length 1.5
  Top Layer w0.254: MODE1.1 39.33,7.88 38.98,7.88
$1N31261: length 2.5
  Top Layer w0.254: 15.41,21.67 15.92,22.19 17.06,22.19 CAN.8
$1N36284: length 1.7
  Top Layer w0.254: R61.2 8.19,32.87 U28.2
$1N49069: length 9.2
  Top Layer w0.508: U13.7 43.54,45.3 arc(43.95,44.92) 44.36,44.53 44.74,44.15 D6.1
$1N49070: length 12.3
  Top Layer w0.254: C33.2 42.65,44.67 39.28,44.67 38.9,45.05 38.9,46.19 39.28,46.57 U13.8
  Top Layer w0.381: U13.8 40.28,47.56 39.47,48.37 arc(38.92,48.69) 38.37,48.99 U14.1
$1N49073: length 6.2
  Top Layer w0.508: R14.1 27.47,42.94 27.47,45.81 28.23,46.57 U11.7
$1N49075: length 23.7
  Top Layer w0.508: U6.7 29.76,30.45 29.12,29.81 29.12,27.3 32.93,23.49 32.93,17.36 34.07,16.22 39.2,16.22 R12.1
$1N49077: length 12
  Top Layer w0.508: U6.5 30.88,26.53 33.69,23.71 33.69,19.22 R11.1
$1N49097: length 4.9
  Top Layer w0.508: D5.1 36.83,41.96 37.63,42.76 U13.5
$1N49104: length 10.1
  Top Layer w0.508: D3.1 26.5,39.17 27.34,38.32 29.25,38.32 30.01,39.08 30.01,43.14 29.12,44.03 U11.5
$1N60408: length 5.5
  Top Layer w0.406: L2.1 17.69,47.52 17.69,45.18 18.07,44.8 DC-DC.5
$1N60409: length 2.5
  Top Layer w0.559: 18.65,48.11 18.89,47.87 DC-DC.6

## Copper pours and planes (outline as drawn; the poured copper is in the pictures)
+3.3V on Top Layer: 4.61,29.17 4.48,29.05 4.48,28.79 5.88,28.79 6.01,28.67 6.9,28.67 8.06,29.84 10.81,29.84 13.09,27.55 13.98,27.55 14.77,26.76 14.77,24.98 16.67,23.08 17.31,23.08 17.69,22.7 17.69,21.26 16.04,21.26 15.95,21.17 14.35,21.17 14.12,20.95 13.88,20.95 13.81,20.77 11.85,20.77 11.85,21.81 10.96,22.7 9.91,22.7 9.1,23.51 9.1,24.05 8.36,24.79 3.5,24.79 3.18,24.48 2.58,24.73 2.11,25.49 1.8,25.78 0,25.78 0,30.36 -0.09,30.45 0.29,32.22 1.08,34.45 3.55,34.45 5.62,32.38 4.86,31.63 4.86,30.83 4.74,30.7 4.74,30.32 4.61,30.19
+3.3V on Top Layer: 5.75,35.01 5.5,34.76 5.5,33.24 6.64,32.08 6.64,31.81 6.52,31.33 5.97,31.33 4.78,31.54 3.85,32.6 3.59,32.6 3.13,33.41 2.83,34.64 3.96,36.41 3.96,36.69 3.99,36.72 4.56,36.72 5.75,35.53
+3.3V on Top Layer: 27.81,4.8 27.86,4.79 27.9,4.76 27.93,4.72 27.94,4.67 27.94,3.9 27.93,3.85 27.9,3.81 27.86,3.78 27.81,3.77 26.59,3.77 26.54,3.78 26.5,3.81 26.47,3.85 26.46,3.9 26.46,4.67 26.47,4.72 26.5,4.76 26.54,4.79 26.59,4.8
+3.3V on Top Layer: 23.66,22.2 23.7,22.19 23.74,22.16 23.77,22.12 23.78,22.07 23.78,21.3 23.77,21.25 23.74,21.21 23.7,21.19 23.66,21.18 22.43,21.18 22.38,21.19 22.34,21.21 22.32,21.25 22.31,21.3 22.31,22.07 22.32,22.12 22.34,22.16 22.38,22.19 22.43,22.2
+3.3V on Top Layer: 5.64,42.35 10.56,47.46 12.48,48.73 14.42,49.84 15.02,49.25 15.66,48.1 17.06,46.26 17.06,45.43 15.53,45.43 15.28,45.18 14.74,45.18 12.08,42.52 8.61,39.77
+3.3V on Top Layer: 8.67,39.8 8.29,39.42 7.91,38.32 6.68,36.84 6.68,36.14 5.65,34.92 5.33,34.92 4.3,35.95 4.3,36.13 3.96,36.47 3.96,37.94 2.87,39.03 2.85,39.03 6.08,42.26 6.22,42.26
+3.3V on Bottom Layer: outline of 152 points within -13.14,-39.71 32.16,5.6
+3.3V on Inner1: outline of 168 points within -0.5,-0.63 52.67,52.54
+5V on Top Layer: 0,26.22 1.34,26.22 2.45,25.11 2.45,23.33 2.58,23.21 2.58,23.02 3.93,22.29 5.86,21.62 6.86,20.97 7.1,21.21 7.1,21 7.02,20.92 7.29,20.66 7.32,20.66 7.32,18.94 7.79,18.48 7.79,18.13 7.91,18 7.91,17.48 8.42,16.97 8.42,16.86 8.55,16.86 9.06,16.35 9.06,16.22 8.61,15.77 8.03,15.77 7.72,15.46 5.41,15.46 3.98,15.08 2.41,14.22 0.85,15.86 0.85,18.27 0.05,19.07 0.05,21.55 0,21.61
+12V on Top Layer: outline of 168 points within -0.28,-0.52 52.68,52.44
+12V on Top Layer: 16.17,37.44 15.91,37.19 15.91,35.02 15.28,34.38 15.28,32.1 15.15,31.97 16.17,30.95 16.17,30.32 16.29,30.19 16.29,28.5 16.93,27.91 19.85,30.83 19.85,32.48 18.45,33.87 18.45,38.03 18.26,38.22 17.74,38.22 16.76,37.24 16.38,37.24
+12V on Top Layer: 15.91,45 15.92,45.02 15.93,45.04 15.94,45.05 15.96,45.05 17.01,45.05 17.02,45.05 17.04,45.04 17.05,45.02 17.06,45 17.06,43.58 17.05,43.56 17.04,43.54 17.02,43.53 17.01,43.53 15.96,43.53 15.94,43.53 15.93,43.54 15.92,43.56 15.91,43.58
+12V on Bottom Layer: outline of 168 points within -0.29,-0.53 52.69,52.45
+12V on Bottom Layer: outline of 110 points within 8.83,31.9 51.15,52
AGND on Top Layer: 12.61,32.6 12.61,29.68 13.63,28.79 16.04,28.79 16.56,29.61 16.56,30.41 15.53,32.7 15.53,34.21 16.16,35.61 15.91,35.97 15.91,36.03 13.75,36.03 12.23,34.51 12.23,32.98
AGND on Top Layer: 12.07,35.45 14.9,37.68 15.63,37.33 16.16,35.61 15.25,33.92 15.02,32.98 14.77,32.73 13.75,32.22 12.48,32.22 11.85,33.16
AGND on Top Layer: 23.32,9.02 23.2,8.9 23.2,8.02 29.47,8.02 30.56,9.11 34.83,9.11 36.73,11.01 39.65,11.01 42.32,13.68 45,13.68 45.12,13.55 45.5,13.94 45.5,17.11 45.12,17.49 45.38,17.49 46.01,18.13 47.05,18.13 47.54,18.61 47.54,19.52 46.9,20.16 45.36,20.16 43.46,18.25 37.96,18.25 37.5,17.8 33.99,17.8 32.9,18.89 32.1,18.89 30.64,17.43 30.64,11.93 30.66,11.92 27.76,9.02
AGND on Bottom Layer: 41.31,42.13 37.76,42.13 37.63,42 36.74,42.89 35.18,42.89 34.84,42.54 34.84,42 34.2,41.37 33.95,41.37 33.69,41.11 33.69,37.46 34.02,37.18 35.22,37.18 35.6,37.56 38.9,37.56 40.76,39.42 41.52,39.42 41.52,41.93
AGND on Bottom Layer: 35.11,7.41 30.77,7.41 29.63,7.97 26.83,8.6 24.42,11.01 23.79,12.03 20.14,16.16 19.18,18.6 12.55,24.19 11.85,28.79 10.9,33.34 12.95,35.77 17.94,35.77 18.45,36.29 18.45,37.68 19.34,38.57 27.47,38.57 30.39,35.65 30.39,31.21 30.88,30.72 30.88,24.49 32.43,22.94 34.03,22.94 34.03,21.34 34.2,21.17 34.2,15.46 34.07,15.33 35.57,13.83 35.8,13.83 35.8,8.8 35.6,8.6 35.6,7.89
AGND on Inner2: 33.77,42.26 32.99,41.69 32.99,36.48 32.17,35.65 29.63,35.65 28.99,35.01 28.74,35.01 28.74,31.59 27.03,29.87 27.03,26.97 28.74,23.97 29.69,23.4 30.14,22.6 30.14,8.52 31.03,7.41 33.02,7.41 33.82,8.21 33.82,9.87 33.44,10.25 33.44,25.91 36.11,30.06 36.4,35.54 37.14,37.73 37.09,41.4 36.23,42.26
GND on Top Layer: 3.04,38.84 2.98,38.78 1.69,36.29 1.08,34.2 1.44,34.2 1.83,33.81 2.49,33.81 4.02,35.34 4.02,36.05 4.13,36.05 4.81,36.72 4.81,37.09
GND on Top Layer: 8.93,39.46 12.23,36.16 14.17,36.16 15.53,37.53 15.53,37.94 16.67,39.08 16.67,43.53 14.52,45.69 13.58,45.69 8.93,41.03
GND on Top Layer: 16.93,44.42 19.22,44.42 19.34,44.54 19.34,45.81 19.22,45.94 19.22,48.28 18.58,48.91 18.58,48.99 17.07,48.73 17.28,48.94 16.38,49.66 16.38,50.91 17.13,51.65 18.44,51.65 20.1,48.37 20.1,43.68 18.86,41.67 17.16,41.67 17.16,42.66 16.74,43.08 16.74,44.22
GND on Top Layer: 9.31,39.97 9.06,39.72 8.17,39.72 7.66,39.21 7.66,38.06 6.52,36.92 6.52,36.03 5.7,35.3 5.91,34.53 6.45,34.13 7.76,34.13 10.28,36.16 11,36.16 11.65,36.03 12.36,36.03 12.74,36.41 12.74,36.54
GND on Top Layer: 0.04,31.59 0.42,31.59 4.1,27.91 9.18,27.91 9.94,28.67 14.16,28.67 14.2,28.71 16.26,28.71 16.92,28.04 19.08,28.04 20.8,26.31 24.74,26.31 25.2,26.77 26.39,26.77 29.2,23.95 30.41,23.95 31.6,22.76 31.6,19 29.99,17.39 29.99,11.88 27.85,9.74 26.58,9.74 26.07,9.24 23.66,9.24 22.97,8.55 22.97,6.52 24.49,8.03 29.49,8.03 30.56,9.11 34.83,9.11 36.77,11.05 39.69,11.05 42.32,13.68 44.87,13.68 45.5,14.32 45.5,17.11 45.38,17.24 45.38,17.49 46.01,18.13 48.68,18.13 49.57,19.02 51.6,19.02 51.98,18.63 51.98,13.17 52.11,13.05 48.68,9.62 48.68,6.44 44.49,2.25 43.85,2.25 38.39,-3.21 34.2,-3.21 31.79,-5.62 21.5,-5.62 16.04,-0.16 9.94,-0.16 4.61,5.17 4.61,5.43 1.18,8.86 0.93,8.86 0.93,11.65 -0.72,13.3 -0.72,18.76 -3.01,21.05 -3.01,25.11 -1.49,26.64 -1.49,27.14 0.04,28.67
GND on Top Layer: 5.88,34.16 5.88,33.37 6.9,32.35 7.02,32.35 7.53,32.6 7.66,32.6 8.05,32.99 9.65,32.99 9.74,33.08 10.99,33.08 11.09,32.98 11.72,32.98 11.78,33.04 11.78,35.65 12.43,36.08 11.08,37.43 9.15,37.43
GND on Top Layer: 17.44,52.16 20.07,52.16 20.54,51.16 20.23,50.77 19.41,50.36 19.22,49.88 18.55,50.2 17.44,51.7
GND on Bottom Layer: 14.35,18.25 9.82,18.25 7.74,20.33 7.74,22.3 6.54,23.51 3.95,23.51 1.8,23.84 -1.61,23.59 -0.34,6.44 1.05,5.05 14.64,4.54 15.29,7.64 15.29,17.31
GND on Inner2: outline of 168 points within -0.28,-0.52 52.68,52.44
A on Bottom Layer: 43.3,16.44 43.3,16.22 42.82,15.74 39.31,15.74 38.7,14.82 33.82,14.82 33.44,15.2 33.44,22.51 35.53,24.6 40.93,24.6 41.06,24.48 41.83,25.25 41.83,26.32 42.4,26.89 45.83,26.89 45.83,20.61 44.62,19.4
B on Top Layer: 29.85,45.81 30.26,46.22 30.26,46.63 30.49,46.86 31.58,46.86 31.88,46.59 31.88,44.92 31.66,44.67 28.26,44.67 27.98,44.92 27.98,45.6 28.25,45.81
B on Bottom Layer: 28.49,44.8 28.61,44.67 27.94,43.99 24.5,43.99 24.19,43.68 24.19,37.96 26.67,35.59 27.73,31.76 27.98,31.51 29.98,28.33 30.28,24.59 32.17,22.7 35.12,22.7 37.68,24.22 41.24,24.22 42.08,25.25 42.08,26.76 41.2,28.03 38.39,28.03 35.47,30.95 35.15,34.98 33.84,36.97 33.84,40.75 36.36,43.27 36.36,43.53 35.6,44.29 35.6,46.7 33.06,49.24 29.38,49.24 28.99,49.62 28.49,49.11
C on Bottom Layer: 39.83,30 45.83,30 45.83,26 39.83,26
C on Bottom Layer: 35.38,37.56 34.39,36.48 35.22,31.03 38.29,27.91 45.83,27.91 45.83,31.79 46.01,31.97 45.48,32.5 44.83,32.5 44.83,32.69 47.16,35.02 47.16,37.33 46.8,37.68 41.95,37.68 41.82,37.56
I_A on Bottom Layer: 35.04,14.28 35.06,14.38 35.11,14.46 35.2,14.51 35.29,14.53 38.43,14.53 38.53,14.51 38.61,14.46 38.67,14.38 38.69,14.28 38.69,7.7 38.67,7.6 38.61,7.52 38.53,7.46 38.43,7.44 35.29,7.44 35.2,7.46 35.11,7.52 35.06,7.6 35.04,7.7
I_B on Bottom Layer: 18.52,44.16 20.87,44.16 20.87,40.75 18.52,40.75
I_B on Bottom Layer: 18.5,42.13 24.04,42.13 24.04,37.92 18.5,37.92
MOS_AH on Top Layer: 43.9,14.77 43.88,14.68 43.83,14.59 43.75,14.54 43.65,14.52 41.79,14.52 41.69,14.54 41.61,14.59 41.56,14.68 41.54,14.77 41.54,18.51 41.56,18.6 41.61,18.69 41.69,18.74 41.79,18.76 43.65,18.76 43.75,18.74 43.83,18.69 43.88,18.6 43.9,18.51
MOS_AH on Bottom Layer: 44.83,19.5 42.69,19.5 42.33,19.14 42.33,18.16 42.71,17.78 42.95,17.78 43.21,17.52 43.21,16.36 43.47,16.09 44.31,16.09 44.53,16.31 44.53,19.2
MOS_AL on Top Layer: 34.32,12.5 34.21,12.52 34.1,12.57 34.01,12.66 33.95,12.78 33.94,12.89 33.94,15.09 33.95,15.19 34.01,15.31 34.1,15.4 34.21,15.45 34.32,15.47 38.03,15.47 38.14,15.45 38.26,15.4 38.34,15.31 38.4,15.19 38.42,15.09 38.42,12.89 38.4,12.78 38.34,12.66 38.26,12.57 38.14,12.52 38.03,12.5
MOS_AL on Bottom Layer: 33.45,14.29 33.47,14.39 33.53,14.47 33.61,14.53 33.7,14.55 34.58,14.55 34.68,14.53 34.76,14.47 34.82,14.39 34.84,14.29 34.84,11.73 34.82,11.63 34.76,11.55 34.68,11.49 34.58,11.47 33.7,11.47 33.61,11.49 33.53,11.55 33.47,11.63 33.45,11.73
MOS_BH on Top Layer: 30.79,44.1 30.8,44.19 30.86,44.28 30.94,44.33 31.04,44.35 32.11,44.35 32.21,44.33 32.29,44.28 32.34,44.19 32.36,44.1 32.36,38.98 32.34,38.88 32.29,38.8 32.21,38.74 32.11,38.73 31.04,38.73 30.94,38.74 30.86,38.8 30.8,38.88 30.79,38.98
MOS_BH on Bottom Layer: 32.03,45.05 29.5,45.05 29.25,44.8 29.25,43.91 29.41,43.74 30.56,43.74 30.77,43.53 30.77,43.33 30.97,43.08 31.98,43.08 32.17,43.27 32.17,44.91
MOS_BL on Top Layer: 22.14,42.99 22.16,43.09 22.22,43.17 22.3,43.23 22.4,43.25 24.26,43.25 24.36,43.23 24.44,43.17 24.49,43.09 24.51,42.99 24.51,38.98 24.49,38.88 24.44,38.8 24.36,38.74 24.26,38.72 22.4,38.72 22.3,38.74 22.22,38.8 22.16,38.88 22.14,38.98
MOS_BL on Bottom Layer: 20.99,43.57 24.07,43.57 24.07,42.23 20.99,42.23
MOS_CH on Top Layer: 41.66,36.03 41.57,36.05 41.48,36.11 41.43,36.19 41.41,36.29 41.41,37.85 41.43,37.95 41.48,38.03 41.57,38.09 41.66,38.11 45.38,38.11 45.48,38.09 45.56,38.03 45.61,37.95 45.63,37.85 45.63,36.29 45.61,36.19 45.56,36.11 45.48,36.05 45.38,36.03
MOS_CH on Bottom Layer: 41.29,37.11 42.46,37.11 42.46,34.13 41.29,34.13
MOS_CH on Bottom Layer: 41.87,37.11 42.44,37.11 42.58,36.97 42.58,35.34 42.46,35.14 41.65,35.14 41.65,36.89
MOS_CL on Top Layer: 38.86,41.47 38.87,41.57 38.93,41.65 39.01,41.71 39.11,41.73 40.8,41.73 40.9,41.71 40.98,41.65 41.04,41.57 41.06,41.47 41.06,37.56 41.04,37.46 40.98,37.38 40.9,37.32 40.8,37.3 39.11,37.3 39.01,37.32 38.93,37.38 38.87,37.46 38.86,37.56
MOS_CL on Bottom Layer: 39.62,41.65 41.05,41.65 41.05,37.94 39.62,37.94
$1N49069 on Top Layer: 41.66,38.32 41.57,38.34 41.48,38.39 41.43,38.48 41.41,38.57 41.41,40.27 41.43,40.36 41.48,40.45 41.57,40.5 41.66,40.52 45.38,40.52 45.47,40.5 45.56,40.45 45.61,40.36 45.63,40.27 45.63,38.57 45.61,38.48 45.56,38.39 45.47,38.34 45.38,38.32
$1N49073 on Top Layer: 27.67,42.55 27.69,42.64 27.74,42.73 27.83,42.78 27.92,42.8 28.99,42.8 29.09,42.78 29.17,42.73 29.23,42.64 29.25,42.55 29.25,39.21 29.23,39.11 29.17,39.03 29.09,38.97 28.99,38.95 27.92,38.95 27.83,38.97 27.74,39.03 27.69,39.11 27.67,39.21
$1N49074 on Top Layer: 31.92,46.95 28.83,46.95 28.35,47.5 28.35,48.15 28.63,48.42 29.78,48.42 30.21,48.86 30.21,49.78 30.43,50.09 31.45,50.09 32.07,48.49 32.07,47.11
$1N49075 on Top Layer: 41.39,14.8 41.38,14.73 41.34,14.63 41.26,14.55 41.16,14.5 41.09,14.49 39.11,14.49 39.04,14.5 38.94,14.55 38.86,14.63 38.82,14.73 38.81,14.8 38.81,18.41 38.82,18.48 38.86,18.58 38.94,18.66 39.04,18.71 39.11,18.72 41.09,18.72 41.16,18.71 41.26,18.66 41.34,18.58 41.38,18.48 41.39,18.41
$1N49077 on Top Layer: 34.42,16.94 34.33,16.96 34.24,17.02 34.19,17.1 34.17,17.2 34.17,18.25 34.19,18.35 34.24,18.43 34.33,18.49 34.42,18.51 38.14,18.51 38.24,18.49 38.32,18.43 38.37,18.35 38.39,18.25 38.39,17.2 38.37,17.1 38.32,17.02 38.24,16.96 38.14,16.94
$1N49078 on Top Layer: 30.14,34 30.09,33.95 30.01,33.87 30.01,31.35 30.37,30.99 33.44,30.99 33.57,31.11 33.57,32.11 33.27,32.4 31.99,32.4 31.79,32.6 31.79,33.87 31.66,34
$1N49097 on Top Layer: 36.33,41.52 36.35,41.62 36.4,41.7 36.48,41.75 36.58,41.77 38.4,41.77 38.5,41.75 38.58,41.7 38.64,41.62 38.66,41.52 38.66,37.61 38.64,37.51 38.58,37.43 38.5,37.37 38.4,37.35 36.58,37.35 36.48,37.37 36.4,37.43 36.35,37.51 36.33,37.61
$1N49104 on Top Layer: 24.73,42.89 24.75,42.99 24.8,43.07 24.88,43.12 24.98,43.14 26.8,43.14 26.9,43.12 26.98,43.07 27.04,42.99 27.06,42.89 27.06,38.97 27.04,38.88 26.98,38.79 26.9,38.74 26.8,38.72 24.98,38.72 24.88,38.74 24.8,38.79 24.75,38.88 24.73,38.97
$1N60408 on Top Layer: 15.1,49.59 15.15,49.39 15.15,47.34 16.93,45.56 16.93,44.92 17.06,44.8 17.06,44.4 17.07,44.4 17.18,44.29 19.34,44.29 19.47,44.42 19.47,45.3 19.33,45.43 18.45,45.43 18.33,45.56 18.33,45.71 18.89,46.28 18.89,48.93 18.71,49.24 18.32,50.02 16.89,49.42 16.39,50.31

Small or netless copper shapes (teardrops, artwork), in the pictures only: 253 on Top Layer, 9 on Bottom Layer, 11 on Inner1, 8 on Inner2

## Text on the board
Top Silkscreen Layer: KEY | DC-DC | USART | LED | RST | OSC | CAN | ADC | Driver | 2026-4-14
